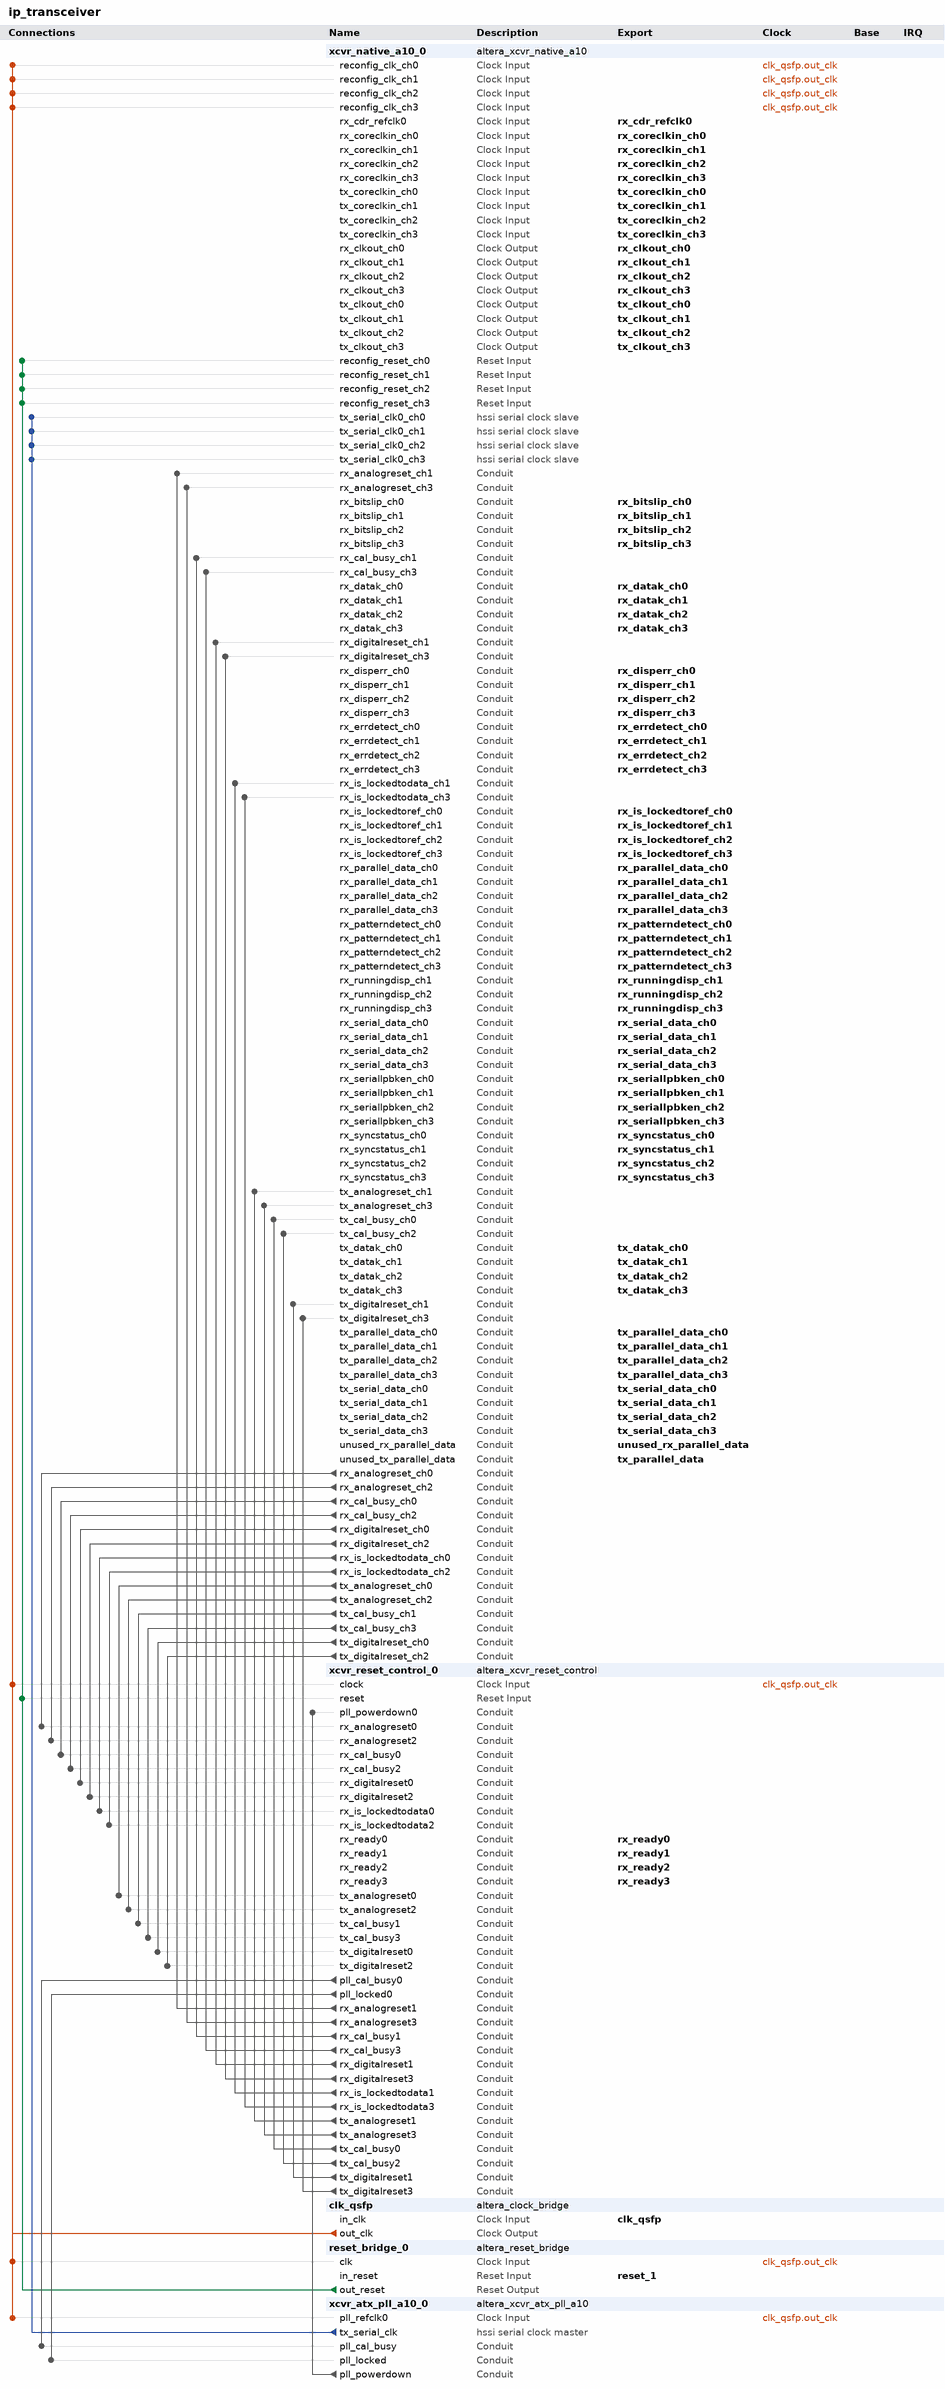
[diagram p0: system contents]
# Platform Designer (Qsys) system ip_transceiver, Arria 10 10AX115N2F45I1SG
# Parameters at their usual value, and those the tool derives, are not listed.
package require -exact qsys 18.0
create_system ip_transceiver
set_project_property DEVICE_FAMILY {Arria 10}
set_project_property DEVICE 10AX115N2F45I1SG

add_instance xcvr_native_a10_0 altera_xcvr_native_a10 18.0
set_instance_parameter_value xcvr_native_a10_0 anlg_voltage 1_0V
set_instance_parameter_value xcvr_native_a10_0 base_device NIGHTFURY5
set_instance_parameter_value xcvr_native_a10_0 bonded_mode not_bonded
set_instance_parameter_value xcvr_native_a10_0 channels 4
set_instance_parameter_value xcvr_native_a10_0 design_environment QSYS
set_instance_parameter_value xcvr_native_a10_0 disable_continuous_dfe false
set_instance_parameter_value xcvr_native_a10_0 enable_pcie_data_mask_option 0
set_instance_parameter_value xcvr_native_a10_0 enable_pcie_dfe_ip false
set_instance_parameter_value xcvr_native_a10_0 enable_port_rx_analog_reset_ack 0
set_instance_parameter_value xcvr_native_a10_0 enable_port_rx_enh_bitslip 0
set_instance_parameter_value xcvr_native_a10_0 enable_port_rx_enh_blk_lock 0
set_instance_parameter_value xcvr_native_a10_0 enable_port_rx_enh_clr_errblk_count 0
set_instance_parameter_value xcvr_native_a10_0 enable_port_rx_enh_data_valid 0
set_instance_parameter_value xcvr_native_a10_0 enable_port_rx_enh_fifo_full 0
set_instance_parameter_value xcvr_native_a10_0 enable_port_rx_enh_fifo_rd_en 0
set_instance_parameter_value xcvr_native_a10_0 enable_port_rx_pma_clkout 0
set_instance_parameter_value xcvr_native_a10_0 enable_port_rx_pma_div_clkout 0
set_instance_parameter_value xcvr_native_a10_0 enable_port_rx_polinv 0
set_instance_parameter_value xcvr_native_a10_0 enable_port_rx_seriallpbken_tx 0
set_instance_parameter_value xcvr_native_a10_0 enable_port_rx_std_bitslip 1
set_instance_parameter_value xcvr_native_a10_0 enable_port_tx_analog_reset_ack 0
set_instance_parameter_value xcvr_native_a10_0 enable_port_tx_enh_fifo_full 0
set_instance_parameter_value xcvr_native_a10_0 enable_port_tx_enh_fifo_pfull 0
set_instance_parameter_value xcvr_native_a10_0 enable_port_tx_pma_clkout 0
set_instance_parameter_value xcvr_native_a10_0 enable_port_tx_pma_div_clkout 0
set_instance_parameter_value xcvr_native_a10_0 enable_port_tx_polinv 0
set_instance_parameter_value xcvr_native_a10_0 enable_ports_rx_manual_cdr_mode 0
set_instance_parameter_value xcvr_native_a10_0 enable_simple_interface 1
set_instance_parameter_value xcvr_native_a10_0 enable_skp_ports 0
set_instance_parameter_value xcvr_native_a10_0 enh_pcs_pma_width 64
set_instance_parameter_value xcvr_native_a10_0 enh_pld_pcs_width 64
set_instance_parameter_value xcvr_native_a10_0 enh_rx_blksync_enable 0
set_instance_parameter_value xcvr_native_a10_0 enh_rx_descram_enable 0
set_instance_parameter_value xcvr_native_a10_0 enh_rxfifo_mode {Phase compensation}
set_instance_parameter_value xcvr_native_a10_0 enh_tx_scram_enable 0
set_instance_parameter_value xcvr_native_a10_0 enh_tx_scram_seed 0
set_instance_parameter_value xcvr_native_a10_0 enh_txfifo_mode {Phase compensation}
set_instance_parameter_value xcvr_native_a10_0 generate_add_hdl_instance_example 0
set_instance_parameter_value xcvr_native_a10_0 generate_docs 1
set_instance_parameter_value xcvr_native_a10_0 protocol_mode basic_std
set_instance_parameter_value xcvr_native_a10_0 rcfg_file_prefix altera_xcvr_native_a10
set_instance_parameter_value xcvr_native_a10_0 rcfg_h_file_enable 0
set_instance_parameter_value xcvr_native_a10_0 rcfg_iface_enable 0
set_instance_parameter_value xcvr_native_a10_0 rcfg_jtag_enable 0
set_instance_parameter_value xcvr_native_a10_0 rcfg_mif_file_enable 0
set_instance_parameter_value xcvr_native_a10_0 rcfg_multi_enable 0
set_instance_parameter_value xcvr_native_a10_0 rcfg_profile_cnt 2
set_instance_parameter_value xcvr_native_a10_0 rcfg_profile_select 1
set_instance_parameter_value xcvr_native_a10_0 rcfg_reduced_files_enable 0
set_instance_parameter_value xcvr_native_a10_0 rcfg_separate_avmm_busy 0
set_instance_parameter_value xcvr_native_a10_0 rcfg_shared 0
set_instance_parameter_value xcvr_native_a10_0 rcfg_sv_file_enable 0
set_instance_parameter_value xcvr_native_a10_0 rx_pma_div_clkout_divider 0
set_instance_parameter_value xcvr_native_a10_0 set_capability_reg_enable 0
set_instance_parameter_value xcvr_native_a10_0 set_cdr_refclk_freq 125.000000
set_instance_parameter_value xcvr_native_a10_0 set_csr_soft_logic_enable 0
set_instance_parameter_value xcvr_native_a10_0 set_data_rate 6250
set_instance_parameter_value xcvr_native_a10_0 set_disconnect_analog_resets 0
set_instance_parameter_value xcvr_native_a10_0 set_odi_soft_logic_enable 0
set_instance_parameter_value xcvr_native_a10_0 set_prbs_soft_logic_enable 0
set_instance_parameter_value xcvr_native_a10_0 sim_reduced_counters false
set_instance_parameter_value xcvr_native_a10_0 std_data_mask_count_multi 0
set_instance_parameter_value xcvr_native_a10_0 std_pcs_pma_width 20
set_instance_parameter_value xcvr_native_a10_0 std_rx_8b10b_enable 1
set_instance_parameter_value xcvr_native_a10_0 std_rx_byte_deser_mode {Deserialize x2}
set_instance_parameter_value xcvr_native_a10_0 std_rx_polinv_enable 0
set_instance_parameter_value xcvr_native_a10_0 std_rx_word_aligner_mode {synchronous state machine}
set_instance_parameter_value xcvr_native_a10_0 std_rx_word_aligner_pattern 643
set_instance_parameter_value xcvr_native_a10_0 std_rx_word_aligner_pattern_len 10
set_instance_parameter_value xcvr_native_a10_0 std_tx_8b10b_enable 1
set_instance_parameter_value xcvr_native_a10_0 std_tx_byte_ser_mode {Serialize x2}
set_instance_parameter_value xcvr_native_a10_0 std_tx_polinv_enable 0
set_instance_parameter_value xcvr_native_a10_0 tx_pma_div_clkout_divider 0

add_instance xcvr_reset_control_0 altera_xcvr_reset_control 18.0
set_instance_parameter_value xcvr_reset_control_0 CHANNELS 4
set_instance_parameter_value xcvr_reset_control_0 RX_PER_CHANNEL 1
set_instance_parameter_value xcvr_reset_control_0 SYS_CLK_IN_MHZ 125
set_instance_parameter_value xcvr_reset_control_0 TX_PER_CHANNEL 1
set_instance_parameter_value xcvr_reset_control_0 TX_PLL_ENABLE 1
set_instance_parameter_value xcvr_reset_control_0 T_RX_ANALOGRESET 70000
set_instance_parameter_value xcvr_reset_control_0 T_TX_ANALOGRESET 70000
set_instance_parameter_value xcvr_reset_control_0 T_TX_DIGITALRESET 70000
set_instance_parameter_value xcvr_reset_control_0 gui_pll_cal_busy 1
set_instance_parameter_value xcvr_reset_control_0 gui_split_interfaces 1

add_instance clk_qsfp altera_clock_bridge 18.0
set_instance_parameter_value clk_qsfp DERIVED_CLOCK_RATE 0
set_instance_parameter_value clk_qsfp EXPLICIT_CLOCK_RATE 125000000

add_instance reset_bridge_0 altera_reset_bridge 18.0
set_instance_parameter_value reset_bridge_0 ACTIVE_LOW_RESET 0
set_instance_parameter_value reset_bridge_0 SYNCHRONOUS_EDGES deassert

add_instance xcvr_atx_pll_a10_0 altera_xcvr_atx_pll_a10 18.0
set_instance_parameter_value xcvr_atx_pll_a10_0 base_device NIGHTFURY5
set_instance_parameter_value xcvr_atx_pll_a10_0 enable_analog_resets 0
set_instance_parameter_value xcvr_atx_pll_a10_0 enable_bonding_clks 0
set_instance_parameter_value xcvr_atx_pll_a10_0 enable_ext_lockdetect_ports 0
set_instance_parameter_value xcvr_atx_pll_a10_0 enable_manual_configuration 1
set_instance_parameter_value xcvr_atx_pll_a10_0 enable_mcgb 0
set_instance_parameter_value xcvr_atx_pll_a10_0 generate_docs 0
set_instance_parameter_value xcvr_atx_pll_a10_0 pma_width 64
set_instance_parameter_value xcvr_atx_pll_a10_0 rcfg_enable_avmm_busy_port 0
set_instance_parameter_value xcvr_atx_pll_a10_0 rcfg_reduced_files_enable 0
set_instance_parameter_value xcvr_atx_pll_a10_0 rcfg_separate_avmm_busy 0
set_instance_parameter_value xcvr_atx_pll_a10_0 set_auto_reference_clock_frequency 125.0
set_instance_parameter_value xcvr_atx_pll_a10_0 set_fref_clock_frequency 156.25
set_instance_parameter_value xcvr_atx_pll_a10_0 set_k_counter 2000000000
set_instance_parameter_value xcvr_atx_pll_a10_0 set_l_cascade_counter 15
set_instance_parameter_value xcvr_atx_pll_a10_0 set_l_cascade_predivider 1
set_instance_parameter_value xcvr_atx_pll_a10_0 set_l_counter 16
set_instance_parameter_value xcvr_atx_pll_a10_0 set_m_counter 24
set_instance_parameter_value xcvr_atx_pll_a10_0 set_manual_reference_clock_frequency 200.0
set_instance_parameter_value xcvr_atx_pll_a10_0 set_output_clock_frequency 3125.0
set_instance_parameter_value xcvr_atx_pll_a10_0 set_rcfg_emb_strm_enable 0

# connections
add_connection clk_qsfp.out_clk reset_bridge_0.clk clock
add_connection clk_qsfp.out_clk xcvr_atx_pll_a10_0.pll_refclk0 clock
add_connection clk_qsfp.out_clk xcvr_native_a10_0.reconfig_clk_ch0 clock
add_connection clk_qsfp.out_clk xcvr_native_a10_0.reconfig_clk_ch1 clock
add_connection clk_qsfp.out_clk xcvr_native_a10_0.reconfig_clk_ch2 clock
add_connection clk_qsfp.out_clk xcvr_native_a10_0.reconfig_clk_ch3 clock
add_connection clk_qsfp.out_clk xcvr_reset_control_0.clock clock
add_connection reset_bridge_0.out_reset xcvr_native_a10_0.reconfig_reset_ch0 reset
add_connection reset_bridge_0.out_reset xcvr_native_a10_0.reconfig_reset_ch1 reset
add_connection reset_bridge_0.out_reset xcvr_native_a10_0.reconfig_reset_ch2 reset
add_connection reset_bridge_0.out_reset xcvr_native_a10_0.reconfig_reset_ch3 reset
add_connection reset_bridge_0.out_reset xcvr_reset_control_0.reset reset
add_connection xcvr_atx_pll_a10_0.pll_powerdown xcvr_reset_control_0.pll_powerdown0 conduit
add_connection xcvr_native_a10_0.rx_analogreset_ch0 xcvr_reset_control_0.rx_analogreset0 conduit
add_connection xcvr_native_a10_0.rx_analogreset_ch2 xcvr_reset_control_0.rx_analogreset2 conduit
add_connection xcvr_native_a10_0.rx_cal_busy_ch0 xcvr_reset_control_0.rx_cal_busy0 conduit
add_connection xcvr_native_a10_0.rx_cal_busy_ch2 xcvr_reset_control_0.rx_cal_busy2 conduit
add_connection xcvr_native_a10_0.rx_digitalreset_ch0 xcvr_reset_control_0.rx_digitalreset0 conduit
add_connection xcvr_native_a10_0.rx_digitalreset_ch2 xcvr_reset_control_0.rx_digitalreset2 conduit
add_connection xcvr_native_a10_0.rx_is_lockedtodata_ch0 xcvr_reset_control_0.rx_is_lockedtodata0 conduit
add_connection xcvr_native_a10_0.rx_is_lockedtodata_ch2 xcvr_reset_control_0.rx_is_lockedtodata2 conduit
add_connection xcvr_native_a10_0.tx_analogreset_ch0 xcvr_reset_control_0.tx_analogreset0 conduit
add_connection xcvr_native_a10_0.tx_analogreset_ch2 xcvr_reset_control_0.tx_analogreset2 conduit
add_connection xcvr_native_a10_0.tx_cal_busy_ch1 xcvr_reset_control_0.tx_cal_busy1 conduit
add_connection xcvr_native_a10_0.tx_cal_busy_ch3 xcvr_reset_control_0.tx_cal_busy3 conduit
add_connection xcvr_native_a10_0.tx_digitalreset_ch0 xcvr_reset_control_0.tx_digitalreset0 conduit
add_connection xcvr_native_a10_0.tx_digitalreset_ch2 xcvr_reset_control_0.tx_digitalreset2 conduit
add_connection xcvr_reset_control_0.pll_cal_busy0 xcvr_atx_pll_a10_0.pll_cal_busy conduit
add_connection xcvr_reset_control_0.pll_locked0 xcvr_atx_pll_a10_0.pll_locked conduit
add_connection xcvr_reset_control_0.rx_analogreset1 xcvr_native_a10_0.rx_analogreset_ch1 conduit
add_connection xcvr_reset_control_0.rx_analogreset3 xcvr_native_a10_0.rx_analogreset_ch3 conduit
add_connection xcvr_reset_control_0.rx_cal_busy1 xcvr_native_a10_0.rx_cal_busy_ch1 conduit
add_connection xcvr_reset_control_0.rx_cal_busy3 xcvr_native_a10_0.rx_cal_busy_ch3 conduit
add_connection xcvr_reset_control_0.rx_digitalreset1 xcvr_native_a10_0.rx_digitalreset_ch1 conduit
add_connection xcvr_reset_control_0.rx_digitalreset3 xcvr_native_a10_0.rx_digitalreset_ch3 conduit
add_connection xcvr_reset_control_0.rx_is_lockedtodata1 xcvr_native_a10_0.rx_is_lockedtodata_ch1 conduit
add_connection xcvr_reset_control_0.rx_is_lockedtodata3 xcvr_native_a10_0.rx_is_lockedtodata_ch3 conduit
add_connection xcvr_reset_control_0.tx_analogreset1 xcvr_native_a10_0.tx_analogreset_ch1 conduit
add_connection xcvr_reset_control_0.tx_analogreset3 xcvr_native_a10_0.tx_analogreset_ch3 conduit
add_connection xcvr_reset_control_0.tx_cal_busy0 xcvr_native_a10_0.tx_cal_busy_ch0 conduit
add_connection xcvr_reset_control_0.tx_cal_busy2 xcvr_native_a10_0.tx_cal_busy_ch2 conduit
add_connection xcvr_reset_control_0.tx_digitalreset1 xcvr_native_a10_0.tx_digitalreset_ch1 conduit
add_connection xcvr_reset_control_0.tx_digitalreset3 xcvr_native_a10_0.tx_digitalreset_ch3 conduit
add_connection xcvr_atx_pll_a10_0.tx_serial_clk xcvr_native_a10_0.tx_serial_clk0_ch0 hssi_serial_clock
add_connection xcvr_atx_pll_a10_0.tx_serial_clk xcvr_native_a10_0.tx_serial_clk0_ch1 hssi_serial_clock
add_connection xcvr_atx_pll_a10_0.tx_serial_clk xcvr_native_a10_0.tx_serial_clk0_ch2 hssi_serial_clock
add_connection xcvr_atx_pll_a10_0.tx_serial_clk xcvr_native_a10_0.tx_serial_clk0_ch3 hssi_serial_clock

# exported interfaces
add_interface clk_qsfp clock sink
set_interface_property clk_qsfp EXPORT_OF clk_qsfp.in_clk
add_interface reset_1 reset sink
set_interface_property reset_1 EXPORT_OF reset_bridge_0.in_reset
add_interface rx_bitslip_ch0 conduit end
set_interface_property rx_bitslip_ch0 EXPORT_OF xcvr_native_a10_0.rx_bitslip_ch0
add_interface rx_bitslip_ch1 conduit end
set_interface_property rx_bitslip_ch1 EXPORT_OF xcvr_native_a10_0.rx_bitslip_ch1
add_interface rx_bitslip_ch2 conduit end
set_interface_property rx_bitslip_ch2 EXPORT_OF xcvr_native_a10_0.rx_bitslip_ch2
add_interface rx_bitslip_ch3 conduit end
set_interface_property rx_bitslip_ch3 EXPORT_OF xcvr_native_a10_0.rx_bitslip_ch3
add_interface rx_cdr_refclk0 clock sink
set_interface_property rx_cdr_refclk0 EXPORT_OF xcvr_native_a10_0.rx_cdr_refclk0
add_interface rx_clkout_ch0 clock source
set_interface_property rx_clkout_ch0 EXPORT_OF xcvr_native_a10_0.rx_clkout_ch0
add_interface rx_clkout_ch1 clock source
set_interface_property rx_clkout_ch1 EXPORT_OF xcvr_native_a10_0.rx_clkout_ch1
add_interface rx_clkout_ch2 clock source
set_interface_property rx_clkout_ch2 EXPORT_OF xcvr_native_a10_0.rx_clkout_ch2
add_interface rx_clkout_ch3 clock source
set_interface_property rx_clkout_ch3 EXPORT_OF xcvr_native_a10_0.rx_clkout_ch3
add_interface rx_coreclkin_ch0 clock sink
set_interface_property rx_coreclkin_ch0 EXPORT_OF xcvr_native_a10_0.rx_coreclkin_ch0
add_interface rx_coreclkin_ch1 clock sink
set_interface_property rx_coreclkin_ch1 EXPORT_OF xcvr_native_a10_0.rx_coreclkin_ch1
add_interface rx_coreclkin_ch2 clock sink
set_interface_property rx_coreclkin_ch2 EXPORT_OF xcvr_native_a10_0.rx_coreclkin_ch2
add_interface rx_coreclkin_ch3 clock sink
set_interface_property rx_coreclkin_ch3 EXPORT_OF xcvr_native_a10_0.rx_coreclkin_ch3
add_interface rx_datak_ch0 conduit end
set_interface_property rx_datak_ch0 EXPORT_OF xcvr_native_a10_0.rx_datak_ch0
add_interface rx_datak_ch1 conduit end
set_interface_property rx_datak_ch1 EXPORT_OF xcvr_native_a10_0.rx_datak_ch1
add_interface rx_datak_ch2 conduit end
set_interface_property rx_datak_ch2 EXPORT_OF xcvr_native_a10_0.rx_datak_ch2
add_interface rx_datak_ch3 conduit end
set_interface_property rx_datak_ch3 EXPORT_OF xcvr_native_a10_0.rx_datak_ch3
add_interface rx_disperr_ch0 conduit end
set_interface_property rx_disperr_ch0 EXPORT_OF xcvr_native_a10_0.rx_disperr_ch0
add_interface rx_disperr_ch1 conduit end
set_interface_property rx_disperr_ch1 EXPORT_OF xcvr_native_a10_0.rx_disperr_ch1
add_interface rx_disperr_ch2 conduit end
set_interface_property rx_disperr_ch2 EXPORT_OF xcvr_native_a10_0.rx_disperr_ch2
add_interface rx_disperr_ch3 conduit end
set_interface_property rx_disperr_ch3 EXPORT_OF xcvr_native_a10_0.rx_disperr_ch3
add_interface rx_errdetect_ch0 conduit end
set_interface_property rx_errdetect_ch0 EXPORT_OF xcvr_native_a10_0.rx_errdetect_ch0
add_interface rx_errdetect_ch1 conduit end
set_interface_property rx_errdetect_ch1 EXPORT_OF xcvr_native_a10_0.rx_errdetect_ch1
add_interface rx_errdetect_ch2 conduit end
set_interface_property rx_errdetect_ch2 EXPORT_OF xcvr_native_a10_0.rx_errdetect_ch2
add_interface rx_errdetect_ch3 conduit end
set_interface_property rx_errdetect_ch3 EXPORT_OF xcvr_native_a10_0.rx_errdetect_ch3
add_interface rx_is_lockedtoref_ch0 conduit end
set_interface_property rx_is_lockedtoref_ch0 EXPORT_OF xcvr_native_a10_0.rx_is_lockedtoref_ch0
add_interface rx_is_lockedtoref_ch1 conduit end
set_interface_property rx_is_lockedtoref_ch1 EXPORT_OF xcvr_native_a10_0.rx_is_lockedtoref_ch1
add_interface rx_is_lockedtoref_ch2 conduit end
set_interface_property rx_is_lockedtoref_ch2 EXPORT_OF xcvr_native_a10_0.rx_is_lockedtoref_ch2
add_interface rx_is_lockedtoref_ch3 conduit end
set_interface_property rx_is_lockedtoref_ch3 EXPORT_OF xcvr_native_a10_0.rx_is_lockedtoref_ch3
add_interface rx_parallel_data_ch0 conduit end
set_interface_property rx_parallel_data_ch0 EXPORT_OF xcvr_native_a10_0.rx_parallel_data_ch0
add_interface rx_parallel_data_ch1 conduit end
set_interface_property rx_parallel_data_ch1 EXPORT_OF xcvr_native_a10_0.rx_parallel_data_ch1
add_interface rx_parallel_data_ch2 conduit end
set_interface_property rx_parallel_data_ch2 EXPORT_OF xcvr_native_a10_0.rx_parallel_data_ch2
add_interface rx_parallel_data_ch3 conduit end
set_interface_property rx_parallel_data_ch3 EXPORT_OF xcvr_native_a10_0.rx_parallel_data_ch3
add_interface rx_patterndetect_ch0 conduit end
set_interface_property rx_patterndetect_ch0 EXPORT_OF xcvr_native_a10_0.rx_patterndetect_ch0
add_interface rx_patterndetect_ch1 conduit end
set_interface_property rx_patterndetect_ch1 EXPORT_OF xcvr_native_a10_0.rx_patterndetect_ch1
add_interface rx_patterndetect_ch2 conduit end
set_interface_property rx_patterndetect_ch2 EXPORT_OF xcvr_native_a10_0.rx_patterndetect_ch2
add_interface rx_patterndetect_ch3 conduit end
set_interface_property rx_patterndetect_ch3 EXPORT_OF xcvr_native_a10_0.rx_patterndetect_ch3
add_interface rx_ready0 conduit end
set_interface_property rx_ready0 EXPORT_OF xcvr_reset_control_0.rx_ready0
add_interface rx_ready1 conduit end
set_interface_property rx_ready1 EXPORT_OF xcvr_reset_control_0.rx_ready1
add_interface rx_ready2 conduit end
set_interface_property rx_ready2 EXPORT_OF xcvr_reset_control_0.rx_ready2
add_interface rx_ready3 conduit end
set_interface_property rx_ready3 EXPORT_OF xcvr_reset_control_0.rx_ready3
add_interface rx_runningdisp_ch1 conduit end
set_interface_property rx_runningdisp_ch1 EXPORT_OF xcvr_native_a10_0.rx_runningdisp_ch1
add_interface rx_runningdisp_ch2 conduit end
set_interface_property rx_runningdisp_ch2 EXPORT_OF xcvr_native_a10_0.rx_runningdisp_ch2
add_interface rx_runningdisp_ch3 conduit end
set_interface_property rx_runningdisp_ch3 EXPORT_OF xcvr_native_a10_0.rx_runningdisp_ch3
add_interface rx_serial_data_ch0 conduit end
set_interface_property rx_serial_data_ch0 EXPORT_OF xcvr_native_a10_0.rx_serial_data_ch0
add_interface rx_serial_data_ch1 conduit end
set_interface_property rx_serial_data_ch1 EXPORT_OF xcvr_native_a10_0.rx_serial_data_ch1
add_interface rx_serial_data_ch2 conduit end
set_interface_property rx_serial_data_ch2 EXPORT_OF xcvr_native_a10_0.rx_serial_data_ch2
add_interface rx_serial_data_ch3 conduit end
set_interface_property rx_serial_data_ch3 EXPORT_OF xcvr_native_a10_0.rx_serial_data_ch3
add_interface rx_seriallpbken_ch0 conduit end
set_interface_property rx_seriallpbken_ch0 EXPORT_OF xcvr_native_a10_0.rx_seriallpbken_ch0
add_interface rx_seriallpbken_ch1 conduit end
set_interface_property rx_seriallpbken_ch1 EXPORT_OF xcvr_native_a10_0.rx_seriallpbken_ch1
add_interface rx_seriallpbken_ch2 conduit end
set_interface_property rx_seriallpbken_ch2 EXPORT_OF xcvr_native_a10_0.rx_seriallpbken_ch2
add_interface rx_seriallpbken_ch3 conduit end
set_interface_property rx_seriallpbken_ch3 EXPORT_OF xcvr_native_a10_0.rx_seriallpbken_ch3
add_interface rx_syncstatus_ch0 conduit end
set_interface_property rx_syncstatus_ch0 EXPORT_OF xcvr_native_a10_0.rx_syncstatus_ch0
add_interface rx_syncstatus_ch1 conduit end
set_interface_property rx_syncstatus_ch1 EXPORT_OF xcvr_native_a10_0.rx_syncstatus_ch1
add_interface rx_syncstatus_ch2 conduit end
set_interface_property rx_syncstatus_ch2 EXPORT_OF xcvr_native_a10_0.rx_syncstatus_ch2
add_interface rx_syncstatus_ch3 conduit end
set_interface_property rx_syncstatus_ch3 EXPORT_OF xcvr_native_a10_0.rx_syncstatus_ch3
add_interface tx_clkout_ch0 clock source
set_interface_property tx_clkout_ch0 EXPORT_OF xcvr_native_a10_0.tx_clkout_ch0
add_interface tx_clkout_ch1 clock source
set_interface_property tx_clkout_ch1 EXPORT_OF xcvr_native_a10_0.tx_clkout_ch1
add_interface tx_clkout_ch2 clock source
set_interface_property tx_clkout_ch2 EXPORT_OF xcvr_native_a10_0.tx_clkout_ch2
add_interface tx_clkout_ch3 clock source
set_interface_property tx_clkout_ch3 EXPORT_OF xcvr_native_a10_0.tx_clkout_ch3
add_interface tx_coreclkin_ch0 clock sink
set_interface_property tx_coreclkin_ch0 EXPORT_OF xcvr_native_a10_0.tx_coreclkin_ch0
add_interface tx_coreclkin_ch1 clock sink
set_interface_property tx_coreclkin_ch1 EXPORT_OF xcvr_native_a10_0.tx_coreclkin_ch1
add_interface tx_coreclkin_ch2 clock sink
set_interface_property tx_coreclkin_ch2 EXPORT_OF xcvr_native_a10_0.tx_coreclkin_ch2
add_interface tx_coreclkin_ch3 clock sink
set_interface_property tx_coreclkin_ch3 EXPORT_OF xcvr_native_a10_0.tx_coreclkin_ch3
add_interface tx_datak_ch0 conduit end
set_interface_property tx_datak_ch0 EXPORT_OF xcvr_native_a10_0.tx_datak_ch0
add_interface tx_datak_ch1 conduit end
set_interface_property tx_datak_ch1 EXPORT_OF xcvr_native_a10_0.tx_datak_ch1
add_interface tx_datak_ch2 conduit end
set_interface_property tx_datak_ch2 EXPORT_OF xcvr_native_a10_0.tx_datak_ch2
add_interface tx_datak_ch3 conduit end
set_interface_property tx_datak_ch3 EXPORT_OF xcvr_native_a10_0.tx_datak_ch3
add_interface tx_parallel_data conduit end
set_interface_property tx_parallel_data EXPORT_OF xcvr_native_a10_0.unused_tx_parallel_data
add_interface tx_parallel_data_ch0 conduit end
set_interface_property tx_parallel_data_ch0 EXPORT_OF xcvr_native_a10_0.tx_parallel_data_ch0
add_interface tx_parallel_data_ch1 conduit end
set_interface_property tx_parallel_data_ch1 EXPORT_OF xcvr_native_a10_0.tx_parallel_data_ch1
add_interface tx_parallel_data_ch2 conduit end
set_interface_property tx_parallel_data_ch2 EXPORT_OF xcvr_native_a10_0.tx_parallel_data_ch2
add_interface tx_parallel_data_ch3 conduit end
set_interface_property tx_parallel_data_ch3 EXPORT_OF xcvr_native_a10_0.tx_parallel_data_ch3
add_interface tx_serial_data_ch0 conduit end
set_interface_property tx_serial_data_ch0 EXPORT_OF xcvr_native_a10_0.tx_serial_data_ch0
add_interface tx_serial_data_ch1 conduit end
set_interface_property tx_serial_data_ch1 EXPORT_OF xcvr_native_a10_0.tx_serial_data_ch1
add_interface tx_serial_data_ch2 conduit end
set_interface_property tx_serial_data_ch2 EXPORT_OF xcvr_native_a10_0.tx_serial_data_ch2
add_interface tx_serial_data_ch3 conduit end
set_interface_property tx_serial_data_ch3 EXPORT_OF xcvr_native_a10_0.tx_serial_data_ch3
add_interface unused_rx_parallel_data conduit end
set_interface_property unused_rx_parallel_data EXPORT_OF xcvr_native_a10_0.unused_rx_parallel_data

set_interconnect_requirement {$system} qsys_mm.clockCrossingAdapter HANDSHAKE
set_interconnect_requirement {$system} qsys_mm.enableEccProtection FALSE
set_interconnect_requirement {$system} qsys_mm.insertDefaultSlave FALSE
set_interconnect_requirement {$system} qsys_mm.maxAdditionalLatency 1

save_system ip_transceiver.qsys
